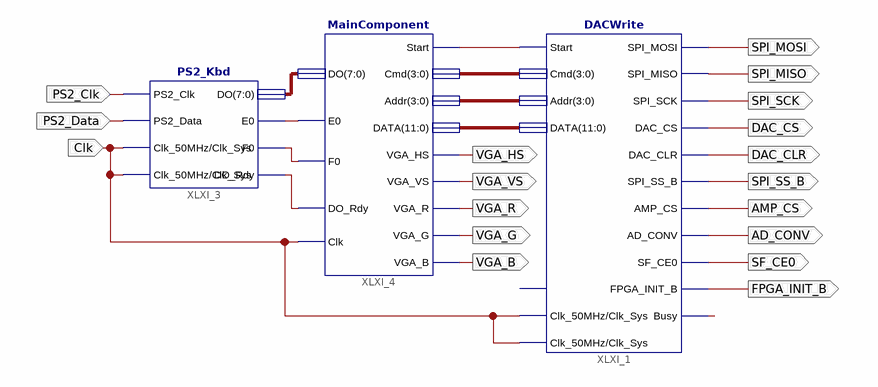
[diagram p0: schematic sheet 1]
// Xilinx ISE schematic Main.sch (spartan3e) as structural Verilog: 3 symbols, 18 ports
module Main (
  input  PS2_Clk,
  input  PS2_Data,
  input  Clk,
  output VGA_HS,
  output VGA_VS,
  output VGA_R,
  output VGA_G,
  output VGA_B,
  output SPI_MOSI,
  output SPI_MISO,
  output SPI_SCK,
  output DAC_CS,
  output DAC_CLR,
  output SPI_SS_B,
  output AMP_CS,
  output AD_CONV,
  output SF_CE0,
  output FPGA_INIT_B
);

  wire XLXN_40, XLXN_81, XLXN_86, XLXN_87, XLXN_88;
  wire [3:0] XLXN_2, XLXN_3;
  wire [7:0] XLXN_41;
  wire [11:0] XLXN_4;

  PS2_Kbd XLXI_3 (
    .PS2_Clk(PS2_Clk), .PS2_Data(PS2_Data), .Clk_50MHz(Clk), .E0(XLXN_86), .F0(XLXN_87), .DO_Rdy(XLXN_88),
    .DO(XLXN_41), .Clk_Sys(Clk));
  MainComponent XLXI_4 (
    .Start(XLXN_81), .Cmd(XLXN_2), .Addr(XLXN_3), .DATA(XLXN_4), .VGA_HS(VGA_HS), .VGA_VS(VGA_VS),
    .VGA_R(VGA_R), .VGA_G(VGA_G), .VGA_B(VGA_B), .Clk(Clk), .E0(XLXN_86), .DO_Rdy(XLXN_88), .F0(XLXN_87),
    .DO(XLXN_41));
  DACWrite XLXI_1 (
    .Start(XLXN_81), .SPI_MISO(SPI_MISO), .Cmd(XLXN_2), .Addr(XLXN_3), .DATA(XLXN_4), .DAC_CLR(DAC_CLR),
    .DAC_CS(DAC_CS), .SPI_MOSI(SPI_MOSI), .SPI_SCK(SPI_SCK), .SPI_SS_B(SPI_SS_B), .AMP_CS(AMP_CS),
    .AD_CONV(AD_CONV), .SF_CE0(SF_CE0), .FPGA_INIT_B(FPGA_INIT_B), .Busy(XLXN_40), .Clk_50MHz(Clk),
    .Clk_Sys(Clk));  // open: Reset
endmodule
